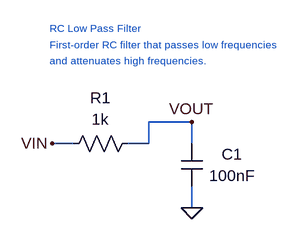
[diagram p0: schematic rc_low_pass_filter.asc]
rc_low_pass_filter.asc, the LTspice schematic file:
Version 4
SHEET 1 512 368
SYMBOL cap 320 192 R0
WINDOW 0 76 16 Center 2
WINDOW 3 76 48 Center 2
SYMATTR InstName C1
SYMATTR Value 100nF
SYMBOL res 144 208 R270
WINDOW 0 84 56 VCenter 2
WINDOW 3 52 56 VCenter 2
SYMATTR InstName R1
SYMATTR Value 1k
WIRE 128 192 160 192
WIRE 240 192 272 192
WIRE 272 160 272 192
WIRE 272 160 336 160
WIRE 336 160 336 192
WIRE 336 256 336 288
FLAG 336 288 0
FLAG 128 192 VIN
FLAG 336 160 VOUT
TEXT 124 20 Left 1 ;RC Low Pass Filter
TEXT 124 44 Left 1 ;First-order RC filter that passes low frequencies
TEXT 124 68 Left 1 ;and attenuates high frequencies.

The netlist it stands for:
* rc_low_pass_filter.asc
C1 VOUT 0 100nF
R1 VIN VOUT 1k
* RC Low Pass Filter
* First-order RC filter that passes low frequencies
* and attenuates high frequencies.
.backanno
.end